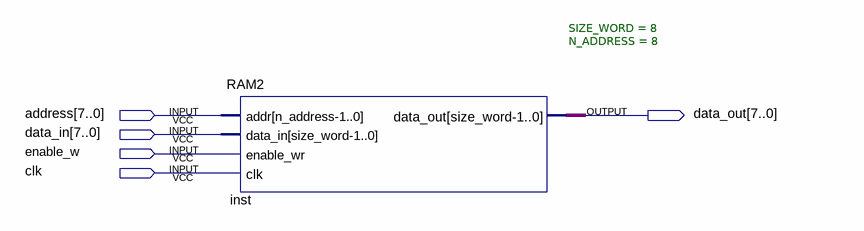
[diagram p0: schematic sheet]
// Quartus schematic test_ram.bdf as structural Verilog: 1 symbols, 5 pins
module test_ram (
  input  [7:0] address,
  input  [7:0] data_in,
  input  enable_w,
  input  clk,
  output [7:0] data_out
);

  RAM2 #(.SIZE_WORD(8), .N_ADDRESS(8)) inst (
    .addr(address), .data_in(data_in), .enable_wr(enable_w), .clk(clk), .data_out(data_out));
endmodule
